# EasyEDA Pro project 赛博樱花灯.epro, board PCB3
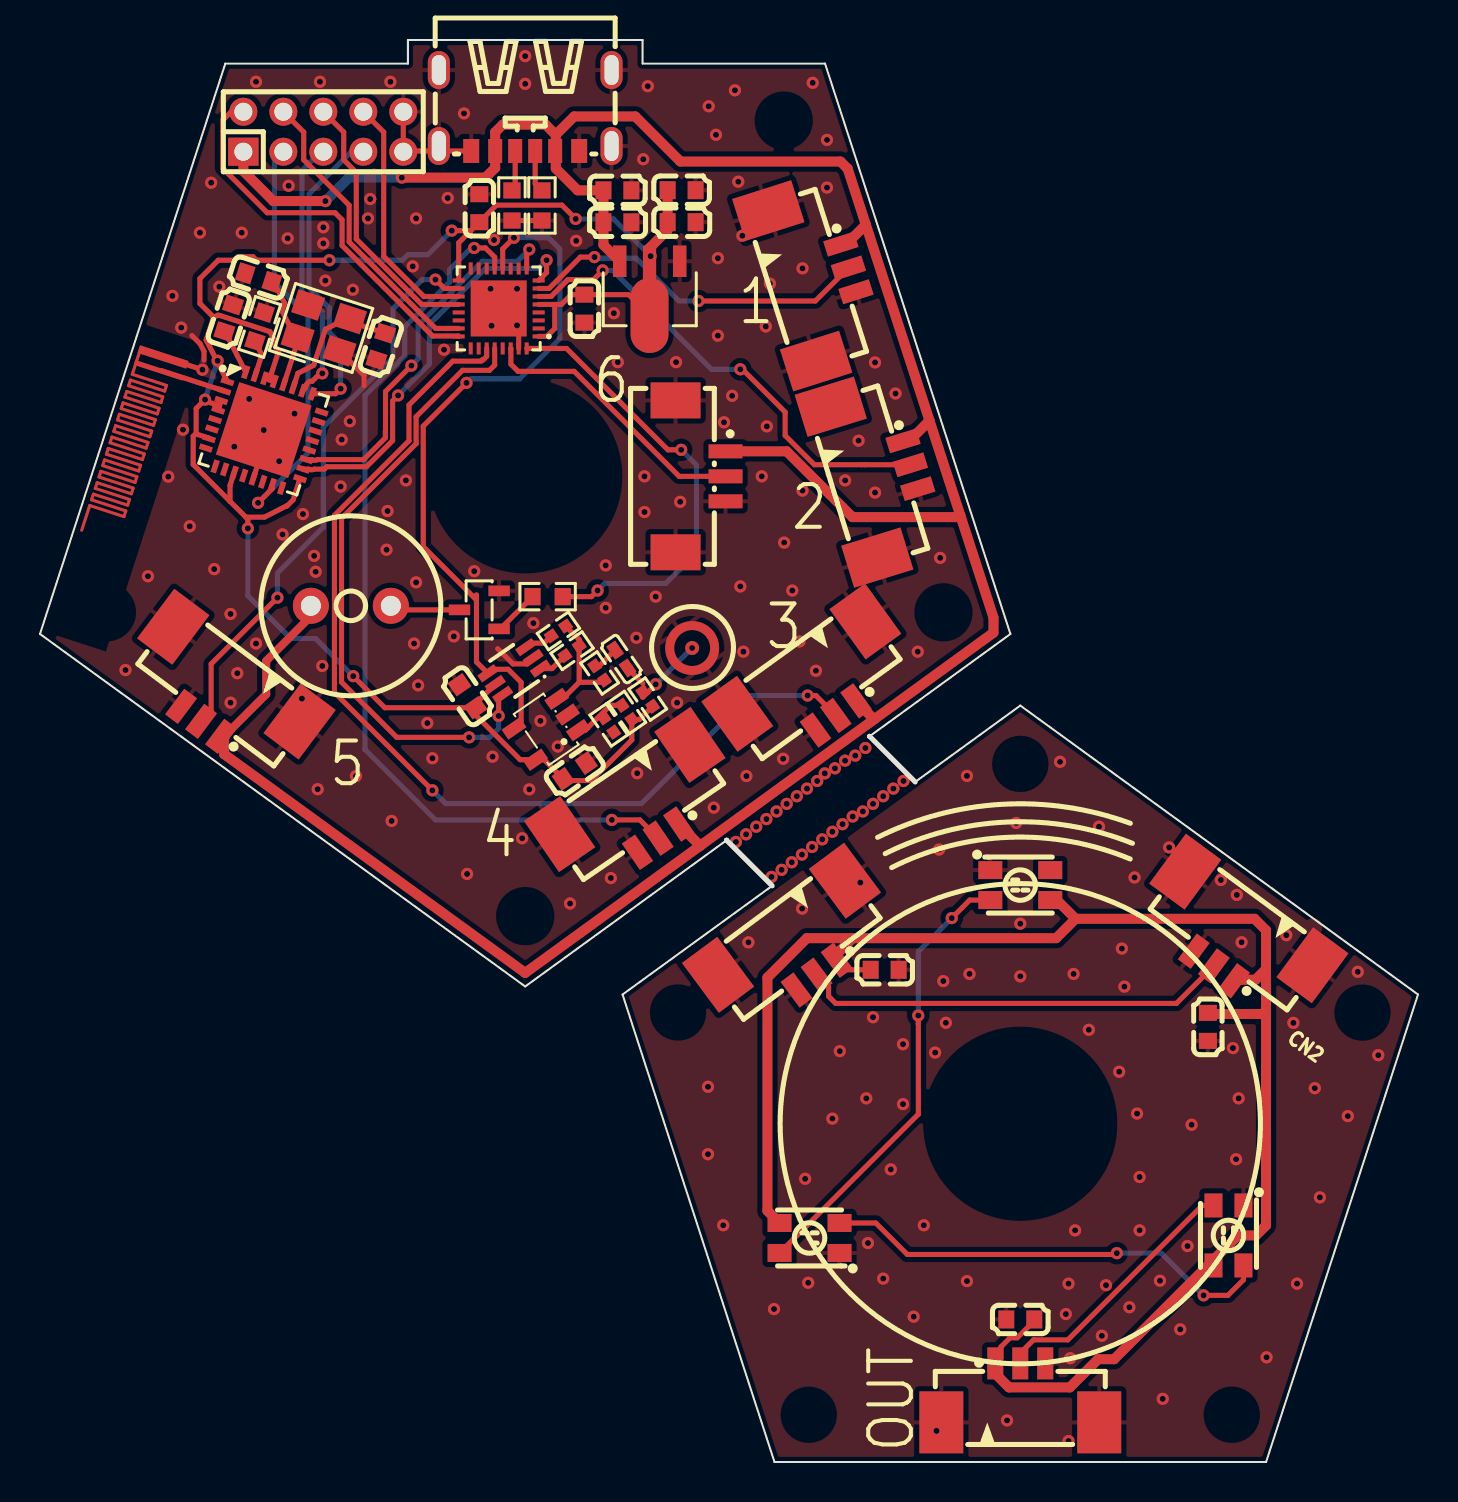
[diagram p12: board, top side]
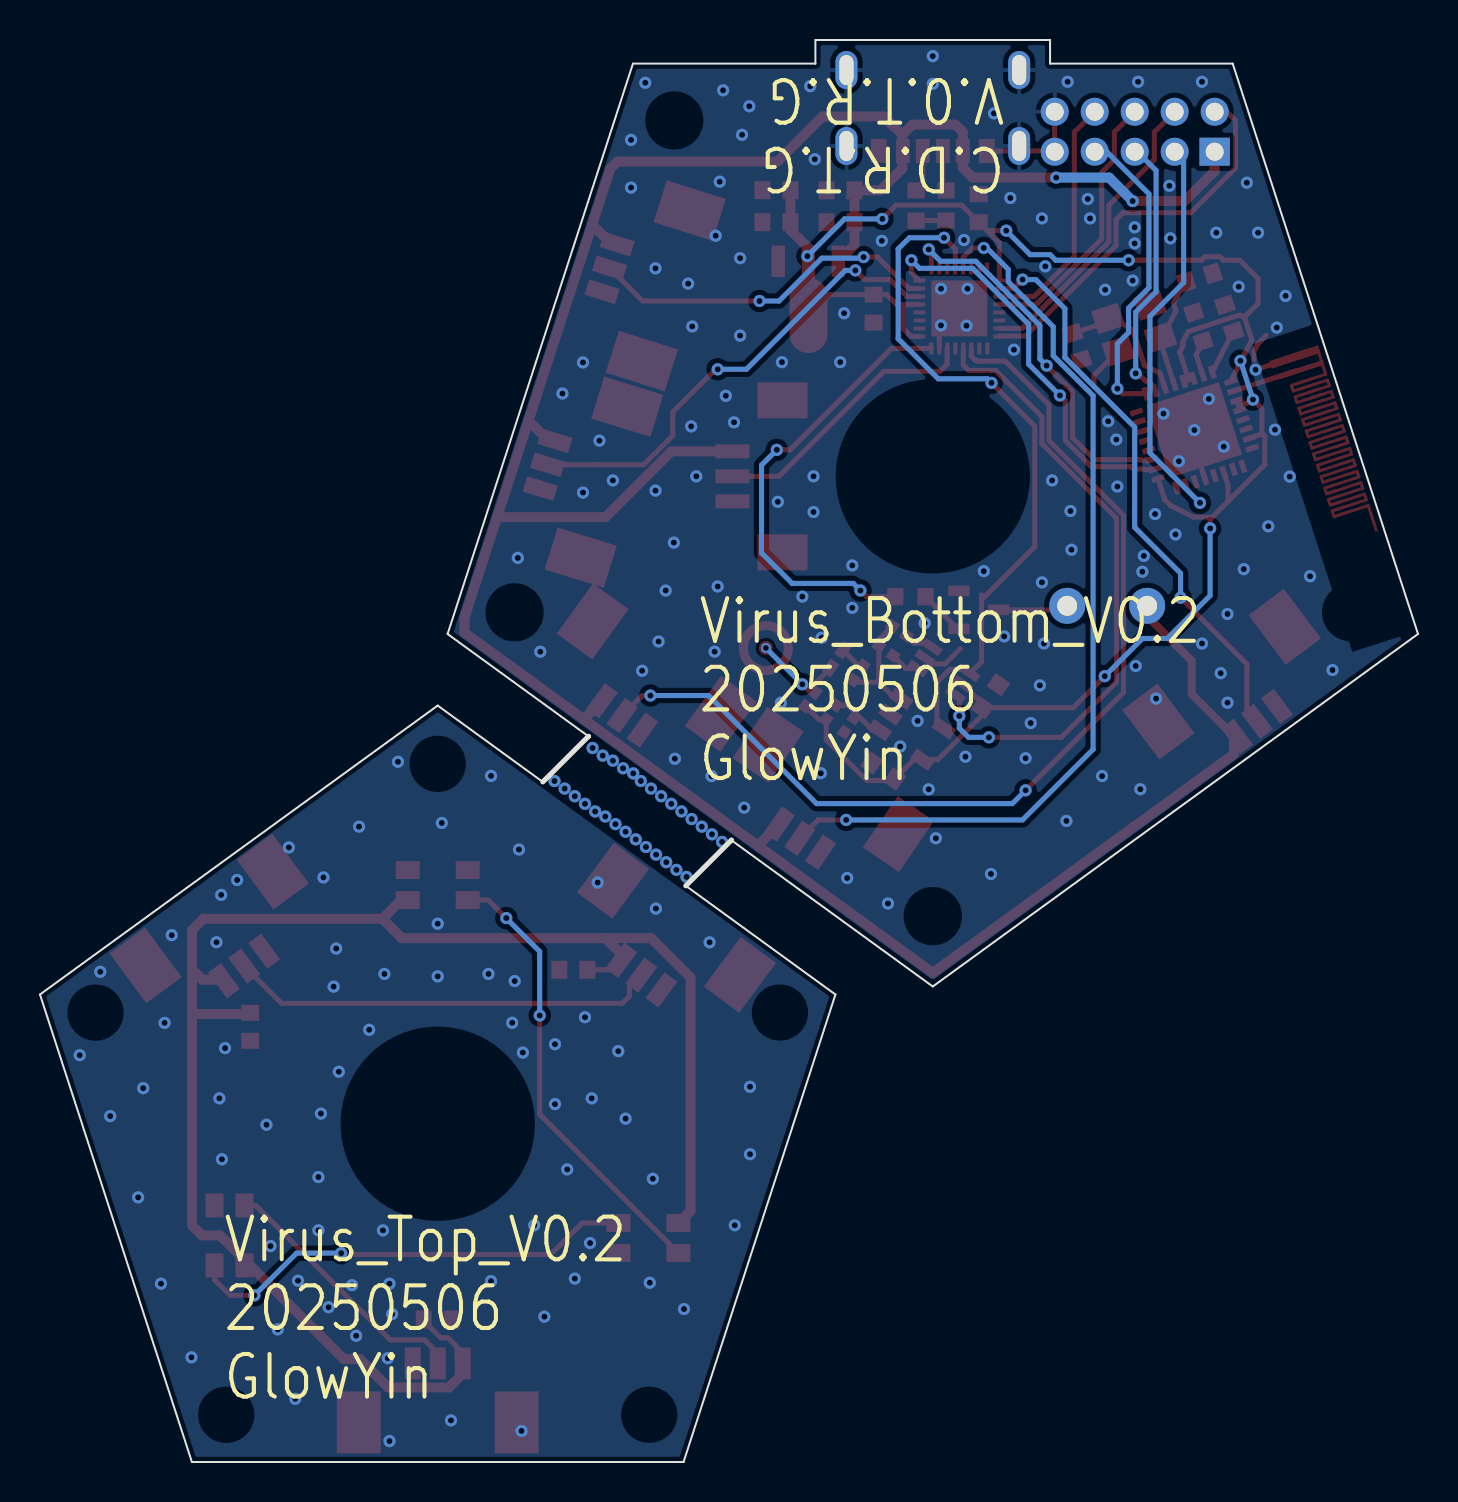
[diagram p13: board, bottom side, seen from below]

Outline 68.93 x 71.14 mm; copper layers: Top Layer, Bottom Layer. Coordinates in mm from the lower left corner of the outline.
Outline path: 34.34,31.11 24.27,23.79 0,41.42 9.27,69.95 18.4,69.95 18.4,71.14 30.14,71.14 30.14,69.95 39.27,69.95 48.54,41.42 41.49,36.3 41.5,36.3 43.78,34.02 49.04,37.84 68.93,23.39 61.33,0 36.74,0 29.14,23.39 36.63,28.82 34.34,31.11 ; 34.34,31.11 34.34,31.11
Stack: Top Layer 0.035mm / Dielectric1 1.51mm FR4 er 4.5 / Bottom Layer 0.035mm

## Design rules (mm)
template: JLCPCB Capability(Two Layers Board)
spacing copperThickness1oz (default): track to track 0.102, other pairs 0.152 to 0.3
spacing copperThickness2oz: track to track 0.203, other pairs 0.152 to 0.3
track width copperThickness1oz (default): min 0.127, default 0.254, max 2.54
track width copperThickness2oz: min 0.203, default 0.254, max 2.54
differential pair differentialPair (default): width min 0.127, default 0.254, max 2.54; gap min 0.152, default 0.152
via viaSize (default): diameter min 0.5, default 0.61, max 10; hole min 0.3, default 0.305, max 6.3

## Placement (name value [footprint] x y rotation side)
ANT1  BT_ANT_2.4G-3  [ANT-2.4G-3]  3.48 47.03 72 top
BUZZER2  2.7kHz  [BUZ-TH_BD9.0-P4.00-D0.6-FD]  15.55 42.83 0 top
C182  1uF  [C0603]  9.44 57.21 252 top
C183  9pF  [C0603]  10.93 59.25 342 top
C184  9pF  [C0603]  17.05 55.8 252 top
C193  10uF  [C0603]  28.88 62.02 180 top
C194  10uF  [C0603]  32.09 62.02 180 top
C215  10uF  [C0402]  29.08 40.17 124.6 top
C216  100nF  [C0603]  21.38 38.31 304.6 top
C217  100nF  [C0603]  26.75 34.57 214.6 top
C218  100nF  [C0603]  28.88 63.62 180 top
C219  100nF  [C0603]  32.09 63.62 180 top
C220  -  [C0603]  58.42 21.77 90 top
C220#2  -  [C0603]  21.98 62.72 270 top
C221  -  [C0603]  42.25 24.62 180 top
C221#2  -  [C0603]  27.23 57.7 90 top
C222  100nF  [C0603]  49.04 7.13 0 top
CN1  HCZZ0015-3  [CONN-SMD_3P-P1.25-L3.3-W8.8#2]  37.97 25.54 216.6 top
CN2  HCZZ0015-3  [CONN-SMD_3P-P1.25-L3.3-W8.8]  59.59 26 143.7 top
CN3  HCZZ0015-3  [CONN-SMD_3P-P1.25-L3.3-W8.8]  49.04 3.46 0 top
CN7  HCZZ0015-3  [CONN-SMD_3P-P1.25-L3.3-W8.8]  8.94 38.23 143.1 top
CN8  HCZZ0015-3  [CONN-SMD_3P-P1.25-L3.3-W8.8]  39.03 59.29 287.6 top
CN9  HCZZ0015-3  [CONN-SMD_3P-P1.25-L3.3-W8.8]  42.13 49.45 287.1 top
CN10  HCZZ0015-3  [CONN-SMD_3P-P1.25-L3.3-W8.8]  38.94 38.54 215.8 top
CN11  HCZZ0015-3  [CONN-SMD_3P-P1.25-L3.3-W8.8]  30.08 32.43 214.4 top
LED1  XL-3528RGBW-WS2812B  [LED-SMD_4P-L3.5-W2.8-BR-1]  59.45 11.33 90 top
LED2  XL-3528RGBW-WS2812B  [LED-SMD_4P-L3.5-W2.8-BR-1]  38.49 11.21 0 top
LED3  XL-3528RGBW-WS2812B  [LED-SMD_4P-L3.5-W2.8-BR-1]  49.04 28.86 180 top
Q1  S8050  [SOT-23-3_L2.9-W1.3-P1.90-LS2.3-BR]  21.98 42.63 0 top
R2  5.1kΩ  [R0603]  23.61 62.86 90 top
R3  5.1kΩ  [R0603]  25.11 62.86 90 top
R133  10kΩ  [R0402]  29.36 37.5 304.6 top
R134  10kΩ  [R0402]  28.45 36.87 124.6 top
R138  1KΩ  [R0402]  27.99 39.47 124.6 top
R139  10kΩ  [R0402]  30.4 38.16 304.6 top
R146  10kΩ  [R0603]  10.98 56.78 252 top
R147  100kΩ  [R0402]  26.62 40.59 214.6 top
R148  50kΩ  [R0402]  25.93 41.57 214.6 top
R149  1kΩ  [R0603]  25.39 43.29 0 top
U1  AT32F415KBU7-4  [QFN-32_L4.0-W4.0-P0.40-BL-EP2.7]  22.95 57.71 90 top
U2  LMV321IDBVR  [SOT-23-5_L3.0-W1.7-P0.95-LS2.8-BR]  25.32 36.65 34.6 top
U97  ESP8285N08  [QFN-32_L5.0-W5.0-P0.50-TL-EP3.7]  11.19 51.62 342 top
U99  26MHz  [CRYSTAL-SMD_4P-L3.2-W2.5-BL]  14.2 56.73 342 top
U102  B4013AM422-42  [MIC-SMD_3P-BD4.0-P1.35_B4013AM423-093]  32.62 40.72 214.6 top
U103  BL1551B  [SC-70-6_L2.1-W1.3-P0.65-LS2.3-BR]  23.72 39.57 34.6 top
U104  AMS1117-3.3  [SOT-89_L4.5-W2.5-P1.50-LS4.2-BR]  30.5 58.71 90 top
U105  WAFER-MX1.25-3PWB  [CONN-SMD_3P-P1.25_WAFER-MX1.25-3PWB]  33.04 49.31 270 top
U107  ZX-PZ2.0-2-5PZZ  [HDR-TH_10P-P2.00-V-M-R2-C5-S2.00]  14.17 66.55 0 top
USB1  TYPE-C 6P  [TYPE-C-SMD_TYPE-C-6P]  24.27 67.61 180 top

## Footprints (pads in the part's own frame, mm; a bottom-side part is the same pattern mirrored in y, then rotated)
ANT-2.4G-3
  oval 1.45x0.15 smd: 1(-0.175,1.2)
  oval 0.15x1.95 smd: 1(0.475,0.3) 1(0.775,0.3) 1(1.075,0.3) 1(1.375,0.3) 1(1.675,0.3) 1(1.974,0.3) 1(2.275,0.3) 1(2.575,0.3) 1(2.874,0.3) 1(3.175,0.3) 1(3.475,0.3) 1(3.775,0.3) 1(4.075,0.3) 1(4.375,0.3) 1(4.675,0.3) 1(4.974,0.3) 1(5.274,0.3) 1(5.574,0.3) 1(5.875,0.3) 1(6.175,0.3) 1(6.475,0.3) 1(6.775,0.3) 1(7.075,0.3) 1(7.375,0.3)
  oval 0.45x0.15 smd: 1(0.625,-0.6) 1(0.924,1.2) 1(1.224,-0.6) 1(1.524,1.2) 1(1.825,-0.6) 1(2.125,1.2) 1(2.425,-0.6) 1(2.725,1.2) 1(3.025,-0.6) 1(3.325,1.2) 1(3.624,-0.6) 1(3.925,1.2) 1(4.224,-0.6) 1(4.524,1.2) 1(4.825,-0.6) 1(5.125,1.2) 1(5.425,-0.6) 1(5.725,1.2) 1(6.024,-0.6) 1(6.324,1.2) 1(6.625,-0.6) 1(6.925,1.2) 1(7.224,-0.6)
  oval 0.8x0.15 smd: 1(7.699,1.2)
  rect 0.25x2.55 smd: 1(7.974,0)
  oval 1.025x0.15 smd: 2(8.362,1.2)
  rect 0.4x2.55 smd: 2(8.675,0)
BUZ-TH_BD9.0-P4.00-D0.6-FD
  round 1.8 hole 1: 1(-2,0) 2(2,0)
C0402
  rect 0.79x0.54 smd: 1(-0.545,0) 2(0.545,0)
C0603
  rect 0.8x0.9 smd: 1(-0.7,0) 2(0.7,0)
CONN-SMD_3P-P1.25-L3.3-W8.8
  rect 0.8x1.6 smd: 1(-1.25,1.475) 2(0,1.475) 3(1.25,1.475)
  rect 2.2x3.1 smd: 4(3.95,-1.475) 5(-3.95,-1.475)
CONN-SMD_3P-P1.25-L3.3-W8.8#2
  rect 0.8x1.6 smd: 1(-1.25,1.475) 2(0,1.475) 3(1.25,1.475)
  rect 2.2x3.1 smd: 4(3.95,-1.475) 5(-3.95,-1.475)
CONN-SMD_3P-P1.25_WAFER-MX1.25-3PWB
  rect 0.7x1.7 smd: 1(-1.25,1.25) 2(0,1.25) 3(1.25,1.25)
  rect 1.8x2.5 smd: 4(-3.8,-1.25) 5(3.8,-1.25)
CRYSTAL-SMD_4P-L3.2-W2.5-BL
  rect 1.4x1.2 smd: 1(-1.1,-0.85) 2(1.1,-0.85) 3(1.1,0.85) 4(-1.1,0.85)
HDR-TH_10P-P2.00-V-M-R2-C5-S2.00
  rect 1.524x1.4 hole 0.9: 1(-4,-1)
  round 1.4 hole 0.9: 2(-4,1) 3(-2,-1) 4(-2,1) 5(0,-1) 6(0,1) 7(2,-1) 8(2,1) 9(4,-1) 10(4,1)
LED-SMD_4P-L3.5-W2.8-BR-1
  rect 1.2x0.9 smd: 1(1.5,-0.75) 2(1.5,0.75) 3(-1.5,0.75) 4(-1.5,-0.75)
MIC-SMD_3P-BD4.0-P1.35_B4013AM423-093
  round 0.7 smd: 1(0,-0.004)
  custom 2.7x1.588 smd: 2(-0.013,1.121)
  custom 2.7x1.582 smd: 2(0.013,-1.121)
QFN-32_L4.0-W4.0-P0.40-BL-EP2.7
  rect 0.2x0.6 smd: 1(-1.4,-2) 2(-1,-2) 3(-0.6,-2) 4(-0.2,-2) 5(0.2,-2) 6(0.6,-2) 7(1,-2) 8(1.4,-2) 17(1.4,2) 18(1,2) 19(0.6,2) 20(0.2,2) 21(-0.2,2) 22(-0.6,2) 23(-1,2) 24(-1.4,2)
  rect 0.6x0.2 smd: 9(2,-1.4) 10(2,-1) 11(2,-0.6) 12(2,-0.2) 13(2,0.2) 14(2,0.6) 15(2,1) 16(2,1.4) 25(-2,1.4) 26(-2,1) 27(-2,0.6) 28(-2,0.2) 29(-2,-0.2) 30(-2,-0.6) 31(-2,-1) 32(-2,-1.4)
  rect 2.8x2.8 smd: 33(0,0)
QFN-32_L5.0-W5.0-P0.50-TL-EP3.7
  rect 0.65x0.28 smd: 1(-2.478,1.75) 2(-2.478,1.25) 3(-2.478,0.75) 4(-2.478,0.25) 5(-2.478,-0.25) 6(-2.478,-0.75) 7(-2.478,-1.25) 8(-2.478,-1.75) 17(2.478,-1.75) 18(2.478,-1.25) 19(2.478,-0.75) 20(2.478,-0.25) 21(2.478,0.25) 22(2.478,0.75) 23(2.478,1.25) 24(2.478,1.75)
  rect 0.28x0.65 smd: 9(-1.75,-2.478) 10(-1.25,-2.478) 11(-0.75,-2.478) 12(-0.25,-2.478) 13(0.25,-2.478) 14(0.75,-2.478) 15(1.25,-2.478) 16(1.75,-2.478) 25(1.75,2.478) 26(1.25,2.478) 27(0.75,2.478) 28(0.25,2.478) 29(-0.25,2.478) 30(-0.75,2.478) 31(-1.25,2.478) 32(-1.75,2.478)
  rect 3.8x3.8 smd: 33(0,0)
R0402
  rect 0.566x0.54 smd: 1(-0.433,0) 2(0.433,0)
R0603
  rect 0.806x0.864 smd: 1(-0.753,0) 2(0.753,0)
SC-70-6_L2.1-W1.3-P0.65-LS2.3-BR
  rect 1x0.42 smd: 1(1.15,-0.65) 2(1.15,0) 3(1.15,0.65) 4(-1.15,0.65) 5(-1.15,0) 6(-1.15,-0.65)
SOT-23-3_L2.9-W1.3-P1.90-LS2.3-BR
  rect 1.07x0.532 smd: 1(0.99,-0.95) 2(0.99,0.95) 3(-0.99,0)
SOT-23-5_L3.0-W1.7-P0.95-LS2.8-BR
  rect 1.1x0.6 smd: 1(1.3,-0.95) 2(1.3,0) 3(1.3,0.95) 4(-1.3,0.95) 5(-1.3,-0.95)
SOT-89_L4.5-W2.5-P1.50-LS4.2-BR
  rect 1.575x0.672 smd: 1(1.356,-1.5) 3(1.356,1.5)
  custom 5.377x1.9 smd: 2(-1.356,0.009)
TYPE-C-SMD_TYPE-C-6P
  oval 1.1x1.9 hole 0.7x1.5: 7(-4.32,1.775) 7(-4.32,-2.025) 7(4.32,1.775) 7(4.32,-2.025)
  rect 0.7x1.2 smd: A5(-0.5,2.025) A9(1.5,2.025) B5(0.5,2.025) B9(-1.5,2.025)
  rect 0.8x1.2 smd: A12(2.7,2.025) B12(-2.7,2.025)

## Nets
3V3: C194.2 C216.2 C217.2 C219.2 C220#2.2 C221#2.2 R133.2 R139.2 U1.1 U1.5 U1.17 U2.5 U97.1 U97.3 U97.4 U97.7 U97.11 U97.17 U97.29 U97.30 U103.5 U104.2
GND: ANT1.2 C182.1 C183.1 C184.2 C193.1 C194.1 C216.1 C217.1 C218.1 C219.1 C220#2.1 C221#2.1 CN7.3 CN7.4 CN7.5 CN8.3 CN8.4 CN8.5 CN9.3 CN9.4 CN10.3 CN10.4 CN10.5 CN11.3 CN11.4 CN11.5 Q1.2 R2.1 R3.1 R134.1 R146.1 U1.31 U1.33 U2.2 U97.13 U97.33 U99.2 U99.4 U102.2 U103.2 U104.1 U105.3 U105.4 U105.5 U107.9 U107.10 USB1.7 USB1.A12 USB1.B12
GND_$C6CM: C220.1 C221.1 C222.1 CN1.3 CN1.4 CN1.5 CN2.3 CN2.4 CN2.5 CN3.3 CN3.4 CN3.5 LED1.1 LED2.1 LED3.1
V5: BUZZER2.1 C193.2 C218.2 CN7.1 CN8.1 CN9.1 CN10.1 CN11.1 U104.3 U105.1 U107.1 USB1.A9 USB1.B9
VCC_$C6CM: C220.2 C221.2 C222.2 CN1.1 CN2.1 CN3.1 LED1.3 LED2.3 LED3.3
$1N828_$C6CM: LED1.4 LED2.2
$1N837_$C6CM: LED2.4 LED3.2
$1N1037_$C6CM: CN1.2 CN2.2
$1N1096_$C6CM: CN3.2 LED1.2
ADC: U1.12 U2.4 U103.4
AUD_MIC: R138.1 R147.1 R148.1 U2.3
BL1551_ENB: U1.28 U103.6
BUZZER: R149.2 U1.32
CC1: R3.2 USB1.A5
CC2: R2.2 USB1.B5
ESP_U0_RX: U97.25 U107.7
ESP_U0_TX: U97.26 U107.5
IO0: U97.15 U107.3
IO2: U97.14
IO4: U97.16
IO5: U97.24
IO9: U1.8 U97.18
IO10: U1.9 U97.19
IO12: U97.10
IO13: U97.12
IO14: U97.9
IO16: U97.8
IO_DBG: U1.20 U107.6
LOG_TX: U1.19 U107.8
SW_CLK: U1.24 U107.2
SW_SDA: U1.23 U107.4
WS0: CN7.2 U1.18
WS1: CN8.2 U1.7
WS2: CN9.2 U1.6
WS3: CN10.2 U1.27
WS4: CN11.2 U1.13
WS5: U1.30 U105.2
$1N431: U1.3
$1N436: U1.2
$1N447: U1.11
$1N449: U1.16
$1N451: U1.14
$1N453: U1.15
$1N459: U1.10
$1N463: U1.22
$1N471: U1.21
$1N481: U1.25
$1N485: U1.26
$1N487: U1.29
$1N1069: ANT1.1 U97.2
$1N1076: C184.1 U97.27 U99.3
$1N1080: C182.2 U97.32
$1N1081: C183.2 U97.28 U99.1
$1N1083: R146.2 U97.31
$1N1545: C215.1 R139.1 U102.1
$1N1546: C215.2 R138.2
$1N2130: R133.1 R134.2 U2.1
$1N2304: R147.2 U103.1
$1N2327: R148.2 U103.3
$1N9735: Q1.1 R149.1
$1N9739: BUZZER2.2 Q1.3

Pads without a net: CN9 5; LED3 4; U1 4; U97 5 6 20 21 22 23

## Via types
v1: diameter 0.61, hole 0.305, Top Layer to Bottom Layer, 263 vias
v2: diameter 0.5, hole 0.3, Top Layer to Bottom Layer, 1 via

## Routing (per net, layer and track width the routed paths; a pad name or vN(x,y) marks a point on that pad's centre or on a via; arc(x,y) is an arc through that point)
3V3: length 103.3
  Top Layer w0.254: U97.17 12.66,48.13 12.35,47.82 12.32,47.82 11.23,47.27 10.3,47.27 ; U97.30 11.5,54.13 ; 11.5,54.13 11.48,54.16 11.92,55.52 11.74,55.88 11.78,56.01 11.5,56.54 8.98,57.36 8.96,57.35 8.9,57.37 8.69,57.26 ; 11.5,54.13 U97.29 ; C216.2 17.25,37.73 v1(15.67,39.31) ; C216.2 21.78,37.37 24.02,35.13 25.22,35.13 C217.2 26.26,34.09 27.57,34.09 29.6,36.12 29.6,37.14 29.98,37.14 R139.2 ; C216.2 21.78,37.93 U103.5 ; v1(10.4,46.71) 10.4,47.17 10.3,47.27 ; 8.69,57.26 8.67,57.2 8.66,57.2 8.31,56.13 U97.1 ; 8.69,57.26 8,57.95 8,59.2 8.92,60.12 9.73,60.12 9.91,60.29 10.65,60.29 10.83,60.12 v1(14.48,60.12) ; 10.3,47.27 9.51,48.06 ; 21.55,61.6 C220#2.2 22.83,62.87 26.11,62.87 v1(26.79,62.19) ; 21.55,61.6 20.95,60.99 U1.17 ; 21.55,61.6 v1(20.6,61.6) ; 8.45,51.2 8.44,51.23 7.86,51.41 7.81,51.46 ; 25.68,57.91 25.75,57.84 25.75,56.7 25.35,56.31 U1.1 ; 25.68,57.91 26.08,57.91 26.57,58.4 29.45,58.4 U104.2 ; 25.68,57.91 U1.5 ; 7.81,51.46 7.66,51.31 7.66,49.9 9.51,48.06 ; 7.81,51.46 7.81,52.7 v1(8.26,53.15) 8.3,53.06 8.98,52.84 ; 9.51,48.06 9.51,48.86 U97.11 ; 8.98,52.84 8.91,52.62 ; 8.98,52.84 U97.3
  Top Layer w0.5: C219.2 31.39,61.63 30.49,60.73 U104.2
  Bottom Layer w0.254: v1(26.79,62.19) 28.68,62.19 v1(30.54,60.32) ; v1(8.26,53.15) 8.25,53.15 v1(8.88,55.09) ; v1(20.6,61.6) 19.4,60.4 18.4,60.4 18.13,60.12 v1(14.48,60.12) ; v1(15.67,39.31) 13.78,41.2 12.54,41.2 10.4,43.34 v1(10.4,46.71)
GND: length 18.7
  Top Layer w0.254: 10.66,49.19 11.35,51.31 v1(11.19,51.62) ; v1(23.86,56.86) 23.95,56.78 U1.31 ; U107.10 U107.9 18.21,65.58 21.57,65.58 ; ANT1.2 v1(8.13,54.64) ; U99.2 16.21,54.35 16.21,53.85 ; R2.1 R3.1 ; 22.89,40.69 23.66,39.92 24.36,39.92 24.67,40.23 ; 8.21,55.12 8.21,55.56 8.01,55.94 7.6,56.35
  vias: v1(4.28,39.62) v1(5.4,44.31) v1(6.42,49.29) v1(6.62,58.33) v1(7.07,56.75) v1(7.15,51.64) v1(7.49,46.81) v1(8,61.5) v1(8.56,64) v1(8.72,44.67) v1(8.97,58.79) v1(9.53,42.42) v1(9.53,37.99) v1(9.72,50.79) v1(9.87,39.46) v1(10.09,61.5) v1(10.47,53.18) v1(10.81,69.05) v1(10.81,40.94) v1(11.96,50.06) v1(12.13,46.4) v1(12.39,61.21) v1(12.44,63.84) v1(12.73,52.44) v1(13.1,38.19) v1(13.15,47.42) v1(13.71,45.33) v1(13.79,44.54) v1(13.89,33.66) v1(14,69.05) v1(14.17,61.77) v1(14.17,60.96) v1(14.12,39.82) v1(14.27,59.1) v1(15.09,51.15) v1(15.04,48.8) v1(15.5,52.06) v1(15.65,58.64) v1(15.8,34.31) v1(16.41,62.21) v1(16.52,63.18) v1(17.39,47.57) v1(17.33,45.64) v1(17.53,69.05) v1(17.59,32.07) v1(18.3,49.1) v1(18.65,59.81) v1(18.71,40.94) v1(18.81,62.21) v1(18.81,44) v1(18.92,38.85) v1(19.37,36.97) v1(19.63,35.21) v1(20.21,55.64) v1(20.39,63.23) v1(20.7,41.3) v1(21.21,67.46) v1(21.36,29.42) v1(21.72,44.56) v1(22.54,58.69) v1(22.59,56.84) v1(22.71,61.13) v1(22.64,35.28) v1(23.86,58.69) v1(24.12,31.2) v1(24.27,70.33) v1(24.27,68.94) v1(24.47,33.65) v1(24.68,41.96) v1(25.03,37.07) v1(25.9,35.79) v1(26.51,27.94) v1(26.82,61.09) v1(28.3,44.85) v1(28.3,42.73) v1(28.55,29.21) v1(28.71,57.47) v1(28.9,55.02) v1(29.83,41.23) v1(29.87,34.46) v1(30.17,65.17) v1(30.24,49.31) v1(30.24,47.52) v1(30.4,68.82) v1(30.8,43.29) v1(31.82,55.02) v1(31.87,37.99) v1(32.02,48.03) v1(33.45,67.82) v1(33.71,32.74) v1(33.81,66.39) v1(33.91,60.22) v1(33.91,56.35) v1(34.22,52.01) v1(34.62,53.34) v1(34.76,68.62) v1(34.93,64.05) v1(35.03,43.8) v1(35.13,61.34) v1(35.18,40.54) v1(35.34,34.31) v1(36.1,49.31) v1(36.31,56.8) v1(36.36,51.81) v1(36.51,58.95) v1(37.17,35.18) v1(37.22,45.99) v1(37.63,43.6) v1(37.99,41.05) v1(38.14,59.71) v1(38.14,48.59) v1(38.65,68.99) v1(38.81,39.58) v1(39.37,66.14) v1(39.37,63.75) v1(40.27,49.1) v1(40.95,51.09) v1(41.77,55.01) v1(41.77,48.5) v1(42.8,53.45) v1(43.91,40.54) v1(45.03,45.23)
GND_$C6CM:
  vias: v1(33.41,18.77) v1(33.41,15.4) v1(34.18,11.84) v1(35.44,26) v1(36.72,7.65) v1(38.12,27.68) v1(38.27,14.17) v1(38.43,8.97) v1(39.64,17.18) v1(40.01,20.55) v1(41.03,28.99) v1(41.33,18.19) v1(41.42,10.95) v1(41.67,22.25) v1(42.18,9.18) v1(42.56,14.64) v1(43.17,20.9) v1(43.17,17.9) v1(43.7,7.27) v1(44.21,11.84) v1(44.78,20.48) v1(44.84,1.56) v1(44.97,30.64) v1(45.19,24.06) v1(45.31,21.97) v1(46.37,34.32) v1(46.37,9.05) v1(46.5,24.42) v1(48.37,2.08) v1(48.83,31.97) v1(49.04,26.93) v1(49.04,24.3) v1(51.02,35.03) v1(51.32,7.4) v1(51.45,8.92) v1(51.45,1.05) v1(51.53,5.19) v1(51.7,24.42) v1(51.78,11.59) v1(52.46,21.62) v1(52.97,31.78) v1(53.12,6.31) v1(53.32,8.85) v1(53.98,19.52) v1(54.12,25.69) v1(54.24,23.78) v1(54.49,7.74) v1(54.75,29.24) v1(54.88,17.43) v1(55,14.26) v1(55,11.59) v1(56.02,9.07) v1(56.16,3.16) v1(56.48,30.74) v1(57.04,6.64) v1(57.4,10.8) v1(57.6,16.87) v1(59.07,29.11) v1(59.67,20.71) v1(59.87,28.37) v1(59.83,15.14) v1(59.96,18.19) v1(60.1,26) v1(61.35,5.24) v1(62.34,26.36) v1(62.7,21.97) v1(62.88,8.92) v1(63.77,18.7) v1(64.02,13.24) v1(65.42,17.3) v1(65.92,24.52) v1(66.94,20.35)
V5: length 145
  Top Layer w0.4: 13.55,42.58 13.55,42.31 11.32,40.08 11.32,38.41 9.21,36.3
  Top Layer w0.5: 41.73,37.15 40.82,38.06 CN10.1 ; 41.73,37.15 33.02,30.83 ; 41.73,37.15 47.7,41.49 47.7,42.24 46.04,47.35 ; 33.02,30.83 24.27,24.47 9.21,35.41 9.21,36.3 CN7.1 ; 33.02,30.83 31.95,31.9 31.95,31.92 ; 41.31,61.9 40.33,60.92 CN8.1 ; 41.31,61.9 40.4,64.7 40.04,65.05 32.03,65.05 29.78,67.31 26.72,67.31 25.8,66.39 ; 41.31,61.9 44.5,52.09 ; 46.04,47.35 44.5,52.09 ; 46.04,47.35 45.96,47.27 40.64,47.27 37.35,50.56 U105.1 ; 44.5,52.09 43.48,51.08 43.17,51.08 ; v1(18.1,64.25) 22.28,64.25 22.77,64.74 22.77,66.52 23.15,66.9 25.29,66.9 25.8,66.39 ; U107.1 10.17,64.58 11.67,63.08 v1(14.27,63.08) ; 25.8,66.39 25.8,64.71 26.89,63.62 C218.2 C193.2 28.18,60.88 U104.3
  Bottom Layer w0.5: v1(14.27,63.08) 15.45,64.25 v1(18.1,64.25)
VCC_$C6CM: length 84.6
  Top Layer w0.254: C222.2 49.74,7.07 48.88,6.21 48.52,6.21 48.07,5.76 48.07,5.21 CN3.1 ; 39.7,25.25 40.33,24.62 C221.2
  Top Layer w0.5: 61.33,24.65 60.8,24.12 59.78,24.12 ; 61.33,24.65 61.33,26.6 60.76,27.17 51.8,27.17 ; 61.33,24.65 61.33,22.41 ; 51.8,27.17 50.83,26.2 40.65,26.2 ; 51.8,27.17 50.86,28.11 LED3.3 ; 40.65,26.2 38.36,26.2 36.39,24.23 36.39,12.56 LED2.3 ; 40.65,26.2 39.7,25.25 ; 61.33,22.41 61.33,11.83 60.83,11.33 59.92,11.33 53.73,5.14 52.93,5.14 51.51,3.73 48.47,3.73 47.66,4.54 47.66,4.81 CN3.1 ; 61.33,22.41 58.27,22.41
(no net):
  vias: v1(34.81,31.02) v1(35.32,31.4) v1(35.83,31.78) v1(36.34,32.16) v1(36.59,29.27) v1(36.84,32.54) v1(37.1,29.62) v1(37.35,32.92) v1(37.61,30) v1(37.86,33.31) v1(38.11,30.38) v1(38.37,33.69) v1(38.62,30.77) v1(38.88,34.07) v1(39.13,31.15) v1(39.26,34.45) v1(39.64,31.53) v1(39.76,34.7) v1(40.15,31.91) v1(40.27,35.08) v1(40.65,32.29) v1(40.78,35.34) v1(41.16,32.54) v1(41.29,35.72) v1(41.67,32.92) v1(42.18,33.31) v1(42.69,33.69) v1(43.19,34.07)
$1N828_$C6CM: length 22.8
  Top Layer w0.254: LED1.4 60.2,9.11 59.42,8.34 v1(58.21,8.34) ; LED2.2 41.81,11.96 43.38,10.38 53.8,10.38 v1(53.86,10.45)
  Bottom Layer w0.254: v1(53.86,10.45) 56.09,10.45 v1(58.21,8.34)
$1N837_$C6CM: length 22.6
  Top Layer w0.254: LED3.2 46.51,28.11 v1(45.61,27.21) ; v1(43.93,22.34) 43.93,21.92 43.94,21.91 43.94,17.4 LED2.4
  Bottom Layer w0.254: v1(45.61,27.21) 43.94,25.54 43.94,22.34 v1(43.93,22.34)
$1N1037_$C6CM: length 21.8
  Top Layer w0.254: 38.69,24.51 39.45,23.76 39.45,23.3 39.8,22.94 56.85,22.94 58.77,24.87
$1N1096_$C6CM: length 13.2
  Top Layer w0.254: CN3.2 49.04,5.45 49.7,6.11 51.41,6.11 58.14,12.83 LED1.2
ADC: length 35.9
  Top Layer w0.254: 21.83,43.12 21.83,40.02 U103.4 22.5,39.45 22.7,39.66 23.42,39.66 24.07,39.01 24.07,37.05 U2.4 ; 21.83,43.12 19.17,45.79 19.17,51.82 v1(21.34,53.98) ; 21.83,43.12 21.83,43.38 ; v1(23.71,61.24) 23.15,60.68 U1.12
  Bottom Layer w0.254: v1(21.34,53.98) 21.54,54.19 24,54.19 26,56.19 26,60.68 25.44,61.24 v1(23.71,61.24)
AUD_MIC: length 5.9
  Top Layer w0.254: 26.97,39.01 26.97,39.01 26.97,41.14 R148.1 ; 26.97,39.01 28.13,39.01 R138.1 ; 26.97,39.01 26.14,38.17 U2.3
BL1551_ENB: length 31.6
  Top Layer w0.254: U1.28 22.75,54.87 22.49,54.61 21.14,54.61 18.81,52.29 18.81,50.94 15.08,47.21 15.08,39.01 17.84,36.25 v1(21.47,36.25) ; v1(22.94,37.32) 22.94,38.19 23.14,38.38
  Bottom Layer w0.254: v1(21.47,36.25) 22.49,36.25 22.94,36.71 v1(22.94,37.32)
BUZZER: length 22.9
  Top Layer w0.254: v1(27.89,43.6) 27.59,43.29 R149.2 ; v1(32.07,50.63) 31.41,50.63 26.34,55.71 U1.32
  Bottom Layer w0.254: v1(27.89,43.6) 28.25,43.95 31.31,43.95 32.84,45.48 32.84,49.87 v1(32.07,50.63)
CC1: length 2.1
  Top Layer w0.254: R3.2 24.77,63.95 24.77,65.58
CC2: length 2
  Top Layer w0.254: R2.2 23.77,63.77 23.77,65.58
ESP_U0_RX: length 15.5
  Top Layer w0.254: v1(15.04,53.69) 14.78,53.44 13.66,53.44
  Bottom Layer w0.254: v1(15.04,53.69) 15.04,55.94 14.48,56.5 14.48,57.72 13.46,58.74 13.46,63.43 15.57,65.55 U107.7
ESP_U0_TX: length 13.4
  Top Layer w0.254: v1(14.12,54.46) 14.01,54.46 13.62,54.07 arc(13.44,54.03) 13.32,53.88 13.27,53.72 U97.26
  Bottom Layer w0.254: v1(14.12,54.46) 14.12,57.52 13.1,58.54 13.1,64.61 14.04,65.55 U107.5
IO0: length 20.7
  Top Layer w0.254: U97.15 11.62,48.69 v1(10.91,47.98)
  Bottom Layer w0.254: U107.3 11.72,65.1 11.72,59 13.41,57.31 13.41,50.48 v1(10.91,47.98)
IO9: length 20
  Top Layer w0.254: 13.74,49.67 14.23,49.67 14.35,49.79 16.33,49.79 17.64,51.1 17.64,53.08 v1(17.91,53.35) ; v1(25.34,60.12) 25.34,59.5 U1.8 ; U97.18 13.42,49.67 13.5,49.65 arc(13.61,49.63) 13.72,49.67
  Bottom Layer w0.254: v1(17.91,53.35) 19.48,54.92 19.48,56.91 22.28,59.71 24.93,59.71 v1(25.34,60.12)
IO10: length 18.9
  Top Layer w0.254: U1.9 24.35,60.53 v1(24.47,60.66) ; v1(18.58,54.85) 17.28,53.55 17.28,51.57 17.28,51.56 17.28,51.24 16.19,50.14 13.88,50.14 arc(13.77,50.11) 13.65,50.12 13.58,50.14 13.32,50.14
  Bottom Layer w0.254: v1(18.58,54.85) 18.92,55.18 18.92,56.86 22.13,60.07 23.88,60.07 v1(24.47,60.66)
IO_DBG: length 13.5
  Top Layer w0.254: U1.20 19.09,57.91 15.82,61.18 15.82,64.51 15.19,65.14 15.19,66.52 U107.6
LOG_TX: length 12.2
  Top Layer w0.254: U107.8 17.19,66.52 17.19,60.31 19.2,58.31 U1.19
SW_CLK: length 19.7
  Top Layer w0.254: U1.24 20.92,56.33 19.64,56.33 15.11,60.85 15.11,62.14 14.76,62.49 11.37,62.49 9.13,64.73 9.13,67.12 9.56,67.55 U107.2
SW_SDA: length 15.1
  Top Layer w0.254: U107.4 13.19,66.52 13.19,65.14 15.47,62.87 15.47,61.03 19.79,56.71 U1.23
WS0: length 28.7
  Top Layer w0.254: CN7.2 8.56,37.56 8.56,39.92 v1(11.88,43.24) ; v1(19.78,59.15) 20.23,58.71 U1.18
  Bottom Layer w0.254: v1(11.88,43.24) 11.88,44.46 14.17,46.76 14.17,51.77 17.66,55.26 17.66,57.7 19.12,59.15 v1(19.78,59.15)
WS1: length 17.7
  Top Layer w0.254: CN8.2 38.78,58.08 v1(32.94,58.08) ; U1.7 25.47,58.71 27.03,60.28 v1(27.73,60.28)
  Bottom Layer w0.254: v1(27.73,60.28) 27.79,60.22 29.82,60.22 31.96,58.08 v1(32.94,58.08)
WS2: length 23.8
  Top Layer w0.254: v1(35.03,54.66) 35.13,54.66 37.28,52.52 37.28,51.35 38.74,49.89 41.11,49.89 arc(41.19,49.89) 41.27,49.89 CN9.2 ; U1.6 25.57,58.31 26.41,59.15 27.69,59.15 v1(28.15,59.61)
  Bottom Layer w0.254: v1(35.03,54.66) 33.59,54.66 28.65,59.61 v1(28.15,59.61)
WS3: length 51.2
  Top Layer w0.254: U1.27 22.35,55.31 22.16,55.13 22.12,55.13 22.06,55.07 20.65,55.07 18.46,52.88 18.46,51.09 14.73,47.36 14.73,38.5 v1(19.63,33.6) ; v1(38.4,38.34) 38.81,38.34 CN10.2
  Bottom Layer w0.254: v1(38.4,38.34) 35.49,38.34 30.08,32.94 20.29,32.94 v1(19.63,33.6)
WS4: length 45.7
  Top Layer w0.254: v1(21.72,60.73) 22.28,60.73 22.75,60.27 U1.13 ; v1(28.61,32.12) 30.01,32.12 CN11.2
  Bottom Layer w0.254: v1(21.72,60.73) 21.57,60.73 20.5,59.66 20.5,59.04 18.25,56.79 18.25,55.34 16.25,53.35 16.25,35.65 19.78,32.12 v1(28.61,32.12)
WS5: length 13.9
  Top Layer w0.254: U1.30 23.56,55.7 23.56,54.92 23.91,54.56 26.72,54.56 31.97,49.31 U105.2
$1N1069: length 3.3
  Top Layer w0.254: 6.08,54.6 U97.2
$1N1076: length 6.7
  Top Layer w0.254: 12.67,53.75 12.9,54.46 13.69,54.87 14.28,56.66 15.2,57.13 17.26,56.47
$1N1080: length 2.3
  Top Layer w0.254: 9.22,56.55 9.26,56.54 U97.32
$1N1081: length 5.7
  Top Layer w0.254: 11.71,59 12.23,57.97 12.11,57.58 12.89,56.05 U97.28 ; 11.71,59.05 11.6,59.08
$1N1083: length 1.8
  Top Layer w0.254: 10.77,54.36 11.1,55.39 10.75,56.06
$1N1545: length 5
  Top Layer w0.254: 30.15,38.7 30.15,38.27 30.16,38.27 v1(30.8,38.9) ; 29.39,39.72 30.15,38.95
  Bottom Layer w0.254: v1(30.8,38.9) 30.8,38.9 v2(32.62,40.72)
$1N1546: length 1.3
  Top Layer w0.254: R138.2 27.98,39.83 C215.2
$1N2130: length 2.7
  Top Layer w0.254: 26.93,36.61 27.28,36.61 28.52,37.85 29.11,37.85
$1N2304: length 1.5
  Top Layer w0.254: R147.2 25.61,39.69 U103.1
$1N2327: length 1.5
  Top Layer w0.254: 25.58,41.33 25.21,40.96 24.59,40.96 24.39,40.76 U103.3
$1N9735: length 2.3
  Top Layer w0.254: Q1.1 23.03,41.68 R149.1
$1N9739: length 3.5
  Top Layer w0.254: Q1.3 17.6,42.63 17.55,42.58

## Copper pours and planes (outline as drawn; the poured copper is in the pictures)
GND on Top Layer: 9.27,69.95 18.4,69.95 18.4,71.14 30.14,71.14 30.14,69.95 39.27,69.95 48.54,60.68 48.54,41.42 39.92,32.8 37.35,32.8 34.81,30.26 34.68,30.26 28.22,23.79 17.63,23.79 0,41.42 0,60.68
GND on Bottom Layer: 9.27,69.95 18.4,69.95 18.4,71.14 30.14,71.14 30.14,69.95 39.27,69.95 48.54,60.68 48.54,41.42 39.92,32.8 37.35,32.8 34.81,30.26 34.68,30.26 28.22,23.79 17.63,23.79 0,41.42 0,60.68
GND_$C6CM on Top Layer: 54.48,37.84 68.93,23.39 68.93,7.48 61.35,-0.09 36.42,-0.09 28.84,7.48 28.84,23.53 35.32,30 37.61,30 43.07,35.46 44.97,35.46 47.35,37.84
GND_$C6CM on Bottom Layer: 54.48,37.84 68.93,23.39 68.93,7.48 61.35,-0.09 36.42,-0.09 28.84,7.48 28.84,23.53 35.32,30 37.61,30 43.07,35.46 44.97,35.46 47.35,37.84

## Text on the board
Bottom Silkscreen Layer: Virus_Bottom_V0.2 / 20250506 / GlowYin | Virus_Top_V0.2 / 20250506 / GlowYin | C.D.R.T.G / V.0.T.R.G
Top Silkscreen Layer: 5 | 4 | 6 | 1 | 3 | 2 | OUT
